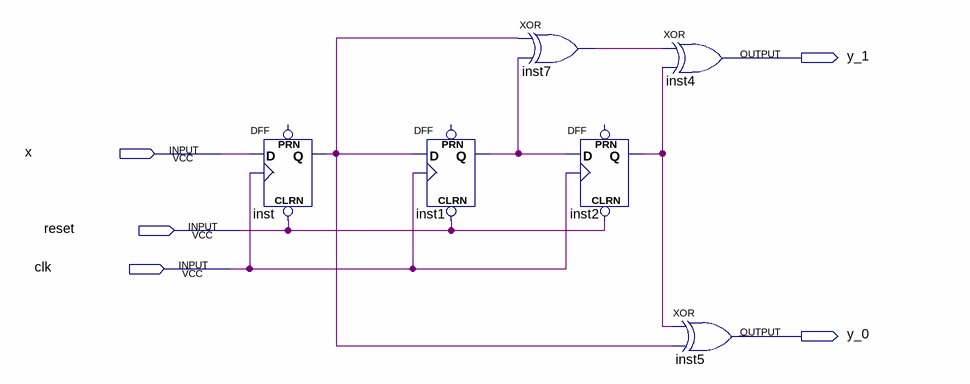
[diagram p0: schematic sheet]
// Quartus schematic Faltungscodierer.bdf as structural Verilog: 6 symbols, 5 pins
module Faltungscodierer (
  input  x,
  input  reset,
  input  clk,
  output y_1,
  output y_0
);

  wire inst1_q, inst2_q, inst7_out, inst_q;

  DFF inst (.CLRN(reset), .CLK(clk), .D(x), .Q(inst_q));  // open: PRN
  DFF inst1 (.CLRN(reset), .CLK(clk), .D(inst_q), .Q(inst1_q));  // open: PRN
  xor inst7 (inst7_out, inst_q, inst1_q);
  DFF inst2 (.CLRN(reset), .CLK(clk), .D(inst1_q), .Q(inst2_q));  // open: PRN
  xor inst4 (y_1, inst7_out, inst2_q);
  xor inst5 (y_0, inst2_q, inst_q);
endmodule
